# EAGLE schematic Schemat (EAGLE 9.6.2)
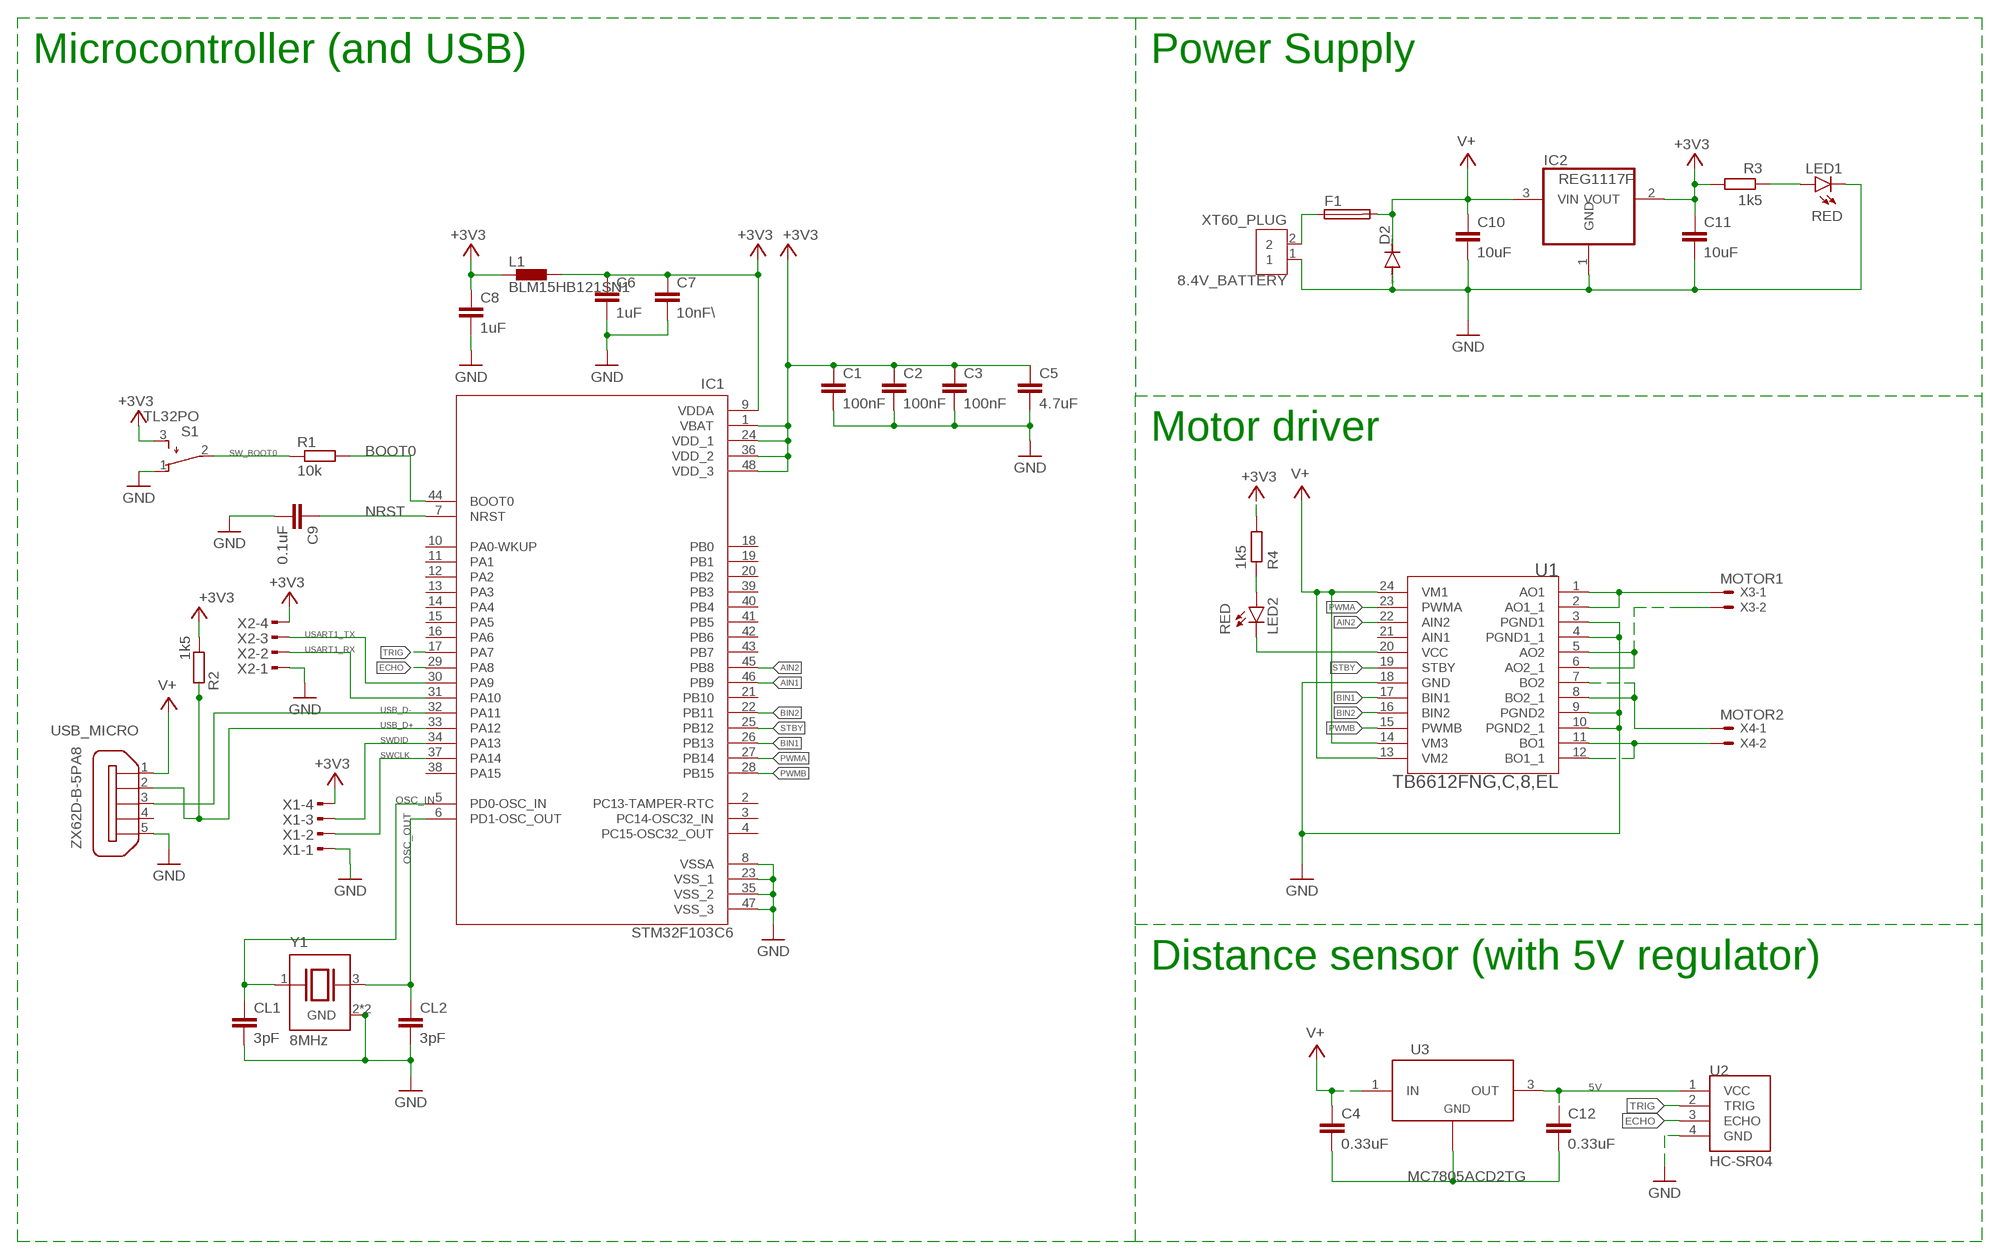
[diagram p0: schematic, sheet 1]

## Parts
8.4V_BATTERY  XT60_PLUG  XT60_YELLOW  [AMASS_XT60PB-M]
C1  100nF  C-EUC0805  [C0805]
C2  100nF  C-EUC0805  [C0805]
C3  100nF  C-EUC0805  [C0805]
C4  0.33uF  C-EUC0805  [C0805]
C5  4.7uF  C-EUC0805  [C0805]
C6  1uF  C-EUC0805  [C0805]
C7  10nF\  C-EUC0805  [C0805]
C8  1uF  C-EUC0805  [C0805]
C9  0.1uF  C-EUC0805  [C0805]
C10  10uF  C-EUC0805  [C0805]
C11  10uF  C-EUC0805  [C0805]
C12  0.33uF  C-EUC0805  [C0805]
CL1  3pF  C-EUC0805  [C0805]
CL2  3pF  C-EUC0805  [C0805]
D2  1N4004  [DO41-10]
F1  19559  [19559]
IC1  STM32F103C6  STM32F103_QFP  [QFP50P900X900X160-48N]
IC2  REG1117F  [DD-3]
L1  BLM15HB121SN1  [0402]
LED1  RED  LED3MM  [LED3MM]
LED2  RED  LED3MM  [LED3MM]
R1  10k  R-EU_0204/2V  [0204V]
R2  1k5  R-EU_0204/2V  [0204V]
R3  1k5  R-EU_R0805  [R0805]
R4  1k5  R-EU_R0805  [R0805]
S1  TL32PO  [TL3XPO]
U1  TB6612FNG,C,8,EL  [SSOP-24]
U2  HC-SR04  [XCVR_HC-SR04]
U3  MC7805ACD2TG  [D2PAK]
USB_MICRO  ZX62D-B-5PA8  [ZX62D-B-5PA8]
X1  MTOP-4  [MTOP-4]
X2  MTOP-4  [MTOP-4]
X3  MOTOR1  53048-02  [53048-02]
X4  MOTOR2  53048-02  [53048-02]
Y1  8MHz  ABMM2-8.0000MHZ-E1-T  [XTAL_ABMM2-8.0000MHZ-E1-T]

## Nets
5V: C12.1 U2.1(VCC) U3.3(OUT)
8.4V: 8.4V_BATTERY.2 F1.1
+3V3: C1.1 C2.1 C3.1 C5.1 C6.1 C7.1 C8.1 C11.1 IC1.1(VBAT) IC1.9(VDDA) IC1.24(VDD_1) IC1.36(VDD_2) IC1.48(VDD_3) IC2.2(VOUT) L1.1 L1.2 R2.2 R3.2 R4.2 S1.3(S) X1.4 X2.4
AIN1: IC1.46(PB9)
AIN2: IC1.45(PB8)
AO1: U1.1(AO1) U1.2(AO1_1) X3.1
AO2: U1.5(AO2) U1.6(AO2_1) X3.2
BIN1: IC1.26(PB13) U1.17(BIN1)
BIN2: IC1.22(PB11)
BO1: U1.11(BO1) U1.12(BO1_1) X4.2
BO2: U1.7(BO2) U1.8(BO2_1) X4.1
BOOT0: IC1.44(BOOT0) R1.2
ECHO: IC1.29(PA8) U2.3(ECHO)
GND: 8.4V_BATTERY.1 C1.2 C2.2 C3.2 C5.2 C6.2 C7.2 C8.2 C9.2 C10.2 C11.2 CL1.1 CL2.1 D2.A IC1.8(VSSA) IC1.23(VSS_1) IC1.35(VSS_2) IC1.47(VSS_3) IC2.1(GND) LED1.K(C) S1.1(O) U1.3(PGND1) U1.4(PGND1_1) U1.9(PGND2) U1.10(PGND2_1) U1.18(GND) U2.4(GND) USB_MICRO.5 X1.1 X2.1 Y1.2(GND) Y1.4(GND)
GND1: C4.2 C12.2 U3.2(ADJ/GND)
N$2: LED1.A R3.1
N$3: U1.23(PWMA)
N$6: U1.22(AIN2)
N$7: LED2.A R4.1
N$15: U1.15(PWMB)
N$16: U1.16(BIN2)
NRST: C9.1 IC1.7(NRST)
OSC_IN: CL1.2 IC1.5(PD0-OSC_IN) Y1.1
OSC_OUT: CL2.2 IC1.6(PD1-OSC_OUT) Y1.3
PWMA: IC1.27(PB14)
PWMB: IC1.28(PB15)
STBY: IC1.25(PB12) U1.19(STBY)
SW_BOOT0: R1.1 S1.2(P)
SWCLK: IC1.37(PA14) X1.2
SWDID: IC1.34(PA13) X1.3
TRIG: IC1.17(PA7) U2.2(TRIG)
USART1_RX: IC1.31(PA10) X2.2
USART1_TX: IC1.30(PA9) X2.3
USB_D+: IC1.33(PA12) R2.1 USB_MICRO.2
USB_D-: IC1.32(PA11) USB_MICRO.3
V+: C4.1 C10.1 D2.C F1.2 IC2.3(VIN) U1.13(VM2) U1.14(VM3) U1.24(VM1) U3.1(IN) USB_MICRO.1
VCC: LED2.K(C) U1.20(VCC)
Unconnected: IC1.2(PC13-TAMPER-RTC) IC1.3(PC14-OSC32_IN) IC1.4(PC15-OSC32_OUT) IC1.10(PA0-WKUP) IC1.11(PA1) IC1.12(PA2) IC1.13(PA3) IC1.14(PA4) IC1.15(PA5) IC1.16(PA6) IC1.18(PB0) IC1.19(PB1) IC1.20(PB2) IC1.21(PB10) IC1.38(PA15) IC1.39(PB3) IC1.40(PB4) IC1.41(PB5) IC1.42(PB6) IC1.43(PB7) U1.21(AIN1) USB_MICRO.4 USB_MICRO.S1 USB_MICRO.S2 USB_MICRO.S3 USB_MICRO.S4

## Notes on the sheet
- Microcontroller (and USB) | Power Supply
- Motor driver
- Distance sensor (with 5V regulator)

## Library data of the parts
8.4V_BATTERY = XT60_YELLOW:XT60_YELLOW: Connector 2 pins Check availability <https://pricing.snapeda.com/parts/XT60%20YELLOW/Pololu/view-part?ref=eda>; AVAILABILITY: Not in stock; DESCRIPTION: Power connector; 65A; PIN: 2; Colour: yellow; MF: Pololu; MP: XT60 YELLOW; PACKAGE: None; PRICE: None
C1-C12 CL1 CL2 = rcl:C-EU: CAPACITOR, European symbol; SPICEPREFIX: C
D2 = diode:1N4004: DIODE general purpose rectifier, 1 A
F1 = fuse:19559: FUSE HOLDER TR5, Wickmann; MPN: 55900000001; OC_FARNELL: 9516360; OC_NEWARK: 02P0286
IC1 = IC_Embedded:STM32F103: Medium-density performance line ARM®-based 32-bit MCU with 64 or 128 KB Flash, USB, CAN, 7 timers, 2 ADCs, 9 com. interfaces Datasheet <https://www.st.com/resource/en/datasheet/stm32f103c8.pdf>; CATEGORY: IC_Embedded; MANUFACTURER: ST Microelectronics; MPN: STM32F103C6T7A; OPERATING_TEMP: -40 to 105 °C; PART_STATUS: Active; SUB-CATEGORY: Microcontroller; THERMALLOSS: 0.44W
IC2 = burr-brown:REG1117: 800mA and 1A Low Dropout (LDO) Positive Regulator 1.8V, 2.5V, 2.85V, 3.3V, 5V, and Adj; MF: TEXAS INSTRUMENTS; MPN: REG1117FAKTTT; OC_FARNELL: 1296120; OC_NEWARK: 87H2562
L1 = inductors:BLM15H: EMIFIL (R) Chip Ferrite Bead for GHz Noise Source: http://www.murata.com/ Ferrite Bead BLM15H.pdf
LED1 LED2 = led:LED: LED OSRAM: - CHIPLED LG R971, LG N971, LY N971, LG Q971, LY Q971, LO R971, LY R971 LH N974, LH R974 LS Q976, LO Q976, LY Q976 LO Q996 - Hyper CHIPLED LW Q18S LB Q993, LB Q99A, LB R99A - SideLED LS A670, LO A670, LY A670, LG A670, LP A670 LB A673, LV A673, LT A673, LW A673 LH A674 LY A675 LS A676, LA A676, LO A676, LY A676, LW A676 LS A679, LY A679, LG A679 - Hyper Micro SIDELED® LS Y876, LA Y876, LO Y876, LY Y876 LT Y87S - SmartLED LW L88C, LW L88S LB L89C, LB L89S, LG L890 LS L89K, LO L89K, LY L89K LS L896, LA L896, LO L896, LY L896 - TOPLED LS T670, LO T670, LY T670, LG T670, LP T670 LSG T670, LSP T670, LSY T670, LOP T670, LYG T670 LG T671, LOG T671, LSG T671 LB T673, LV T673, LT T673, LW T673 LH T674 LS T676, LA T676, LO T676, LY T676, LB T676, LH T676, LSB T676, LW T676 LB T67C, LV T67C, LT T67C, LS T67K, LO T67K, LY T67K, LW E67C LS E67B, LA E67B, LO E67B, LY E67B, LB E67C, LV E67C, LT E67C LW T67C LS T679, LY T679, LG T679 LS T770, LO T770, LY T770, LG T770, LP T770 LB T773, LV T773, LT T773, LW T773 LH T774 LS E675, LA E675, LY E675, LS T675 LS T776, LA T776, LO T776, LY T776, LB T776 LHGB T686 LT T68C, LB T68C - Hyper Mini TOPLED® LB M676 - Mini TOPLED Santana® LG M470 LS M47K, LO M47K, LY M47K Source: http://www.osram.convergy.de LUXEON: - LUMILED® LXK2-PW12-R00, LXK2-PW12-S00, LXK2-PW14-U00, LXK2-PW14-V00 LXK2-PM12-R00, LXK2-PM12-S00, LXK2-PM14-U00 LXK2-PE12-Q00, LXK2-PE12-R00, LXK2-PE12-S00, LXK2-PE14-T00, LXK2-PE14-U00 LXK2-PB12-K00, LXK2-PB12-L00, LXK2-PB12-M00, LXK2-PB14-N00, LXK2-PB14-P00, LXK2-PB14-Q00 LXK2-PR12-L00, LXK2-PR12-M00, LXK2-PR14-Q00, LXK2-PR14-R00 LXK2-PD12-Q00, LXK2-PD12-R00, LXK2-PD12-S00 LXK2-PH12-R00, LXK2-PH12-S00 LXK2-PL12-P00, LXK2-PL12-Q00, LXK2-PL12-R00 Source: www.luxeon.com KINGBRIGHT: KA-3528ASYC Source: www.kingbright.com
R1-R4 = rcl:R-EU_: RESISTOR, European symbol; SPICEPREFIX: R
S1 = switch:TL32PO: TINY SWITCH ON - MOM Source: http://www2.produktinfo.conrad.com/datenblaetter/700000-724999/705152-da-01-de-Subminiaturschalter_TL_36YO.pdf
U1 = IC:TB6612FNG,C,8,EL: IC MOTOR DRIVER 2.7V-5.5V 24SSOP Manufacturer's datasheet <https://toshiba.semicon-storage.com/info/docget.jsp?did=10660&prodName=TB6612FNG>; CREATED_BY: PCBLayout.com; DIGI-KEY_PART: TB6612FNGC8ELCT-ND; MANUFACTURER: Toshiba Semiconductor and Storage; MPN: TB6612FNG,C,8,EL; PACKAGE: SSOP-24
U2 = HC-SR04:HC-SR04: Ultrasonic Sensor Module Check availability <https://pricing.snapeda.com/parts/HC-SR04/OSEPP%20Electronics/view-part?ref=eda>; AVAILABILITY: In Stock; DESCRIPTION: HC-SR04 Ultrasonic Sensor - Platform Evaluation Expansion Board; MF: OSEPP Electronics; MP: HC-SR04; PACKAGE: None; PRICE: None; PURCHASE-URL: https://pricing.snapeda.com/search/part/HC-SR04/?ref=eda
U3 = IC:MC7805ACD2TG: IC REG LINEAR 5V 1A D2PAK Manufacturer's datasheet <https://www.onsemi.cn/PowerSolutions/document/MC7800-D.PDF>; CREATED_BY: PCBLayout.com; DIGIKEY_PART_NUMBER: MC7805ACD2TGOS-ND; MANUFACTURER: ON Semiconductor; MPN: MC7805ACD2TG; PACKAGE: D2PAK
USB_MICRO = zx62d-b-5pa8-oshpark_10:ZX62D-B-5PA8: Micro USB Type B Connector - Standard, Shell Through Hole Source: http://www.hirose.co.jp/cataloge_hp/ed_ZX_20140804.pdf; MF: Hirose; MPN: ZX62D-B-5PA8; OC_FARNELL: 2300438; OC_NEWARK: 69W0712
X1 X2 = con-amp:MTOP-4: AMP connector
X3 X4 = con-molex:53?-02: CONNECTOR wire to board 1.25 mm (.049 inch) pitch header; MF: MOLEX; MPN: 53048-0210; OC_FARNELL: 1012259; OC_NEWARK: 57H4718
Y1 = ABMM2-8.0000MHZ-E1-T:ABMM2-8.0000MHZ-E1-T: Check availability <https://pricing.snapeda.com/parts/ABMM2-8.0000MHZ-E1-T/Abracon/view-part?ref=eda>; AVAILABILITY: In Stock; DESCRIPTION: Crystals 8MHz 18pF 10PPM -20 +70C; MF: Abracon; MP: ABMM2-8.0000MHZ-E1-T; PACKAGE: Package; PRICE: None